# EAGLE schematic load-cell (EAGLE 9.6.2)
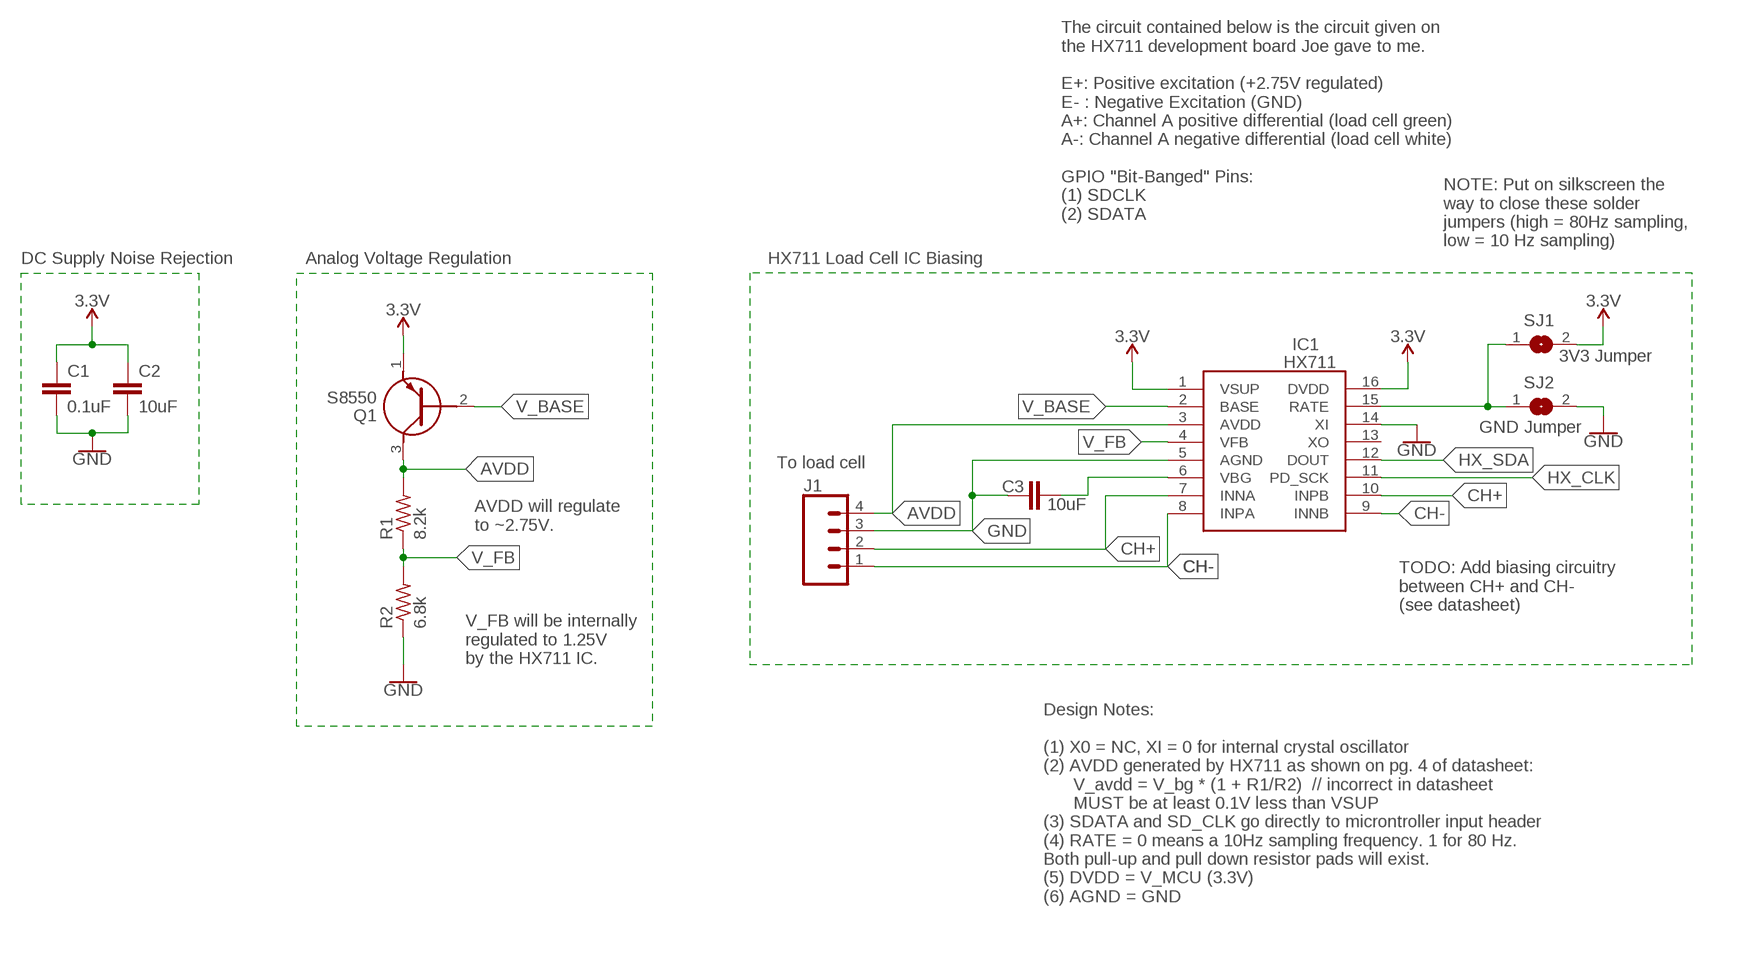
[diagram p0: schematic, sheet 1]

## Parts
C1  0.1uF  CAPACITOR0603  [C0603]
C2  10uF  CAPACITOR0603  [C0603]
C3  10uF  CAPACITOR0603  [C0603]
IC1  HX711  [SOIC127P600X160-16N]
J1  CONN_04  [1X04]
Q1  S8550  [MJE13001TP]
R1  8.2k  RESISTOR0603  [R0603]
R2  6.8k  RESISTOR0603  [R0603]
SJ1  3V3 Jumper  SJ  [SJ]
SJ2  GND Jumper  SJ  [SJ]

## Nets
3.3V: C1.1 C2.1 IC1.1(VSUP) IC1.16(DVDD) Q1.1(E) SJ1.2
AVDD: IC1.3(AVDD) J1.4 Q1.3(C) R1.2
CH+: IC1.7(INNA) IC1.10(INPB) J1.2
CH-: IC1.8(INPA) IC1.9(INNB) J1.1
GND: C1.2 C2.2 C3.1 IC1.5(AGND) IC1.14(XI) J1.3 R2.1 SJ2.2
HX_CLK: IC1.11(PD_SCK)
HX_SDA: IC1.12(DOUT)
N$2: C3.2 IC1.6(VBG)
N$7: IC1.15(RATE) SJ1.1 SJ2.1
V_BASE: IC1.2(BASE) Q1.2(B)
V_FB: IC1.4(VFB) R1.1 R2.2
Unconnected: IC1.13(XO)

## Notes on the sheet
- The circuit contained below is the circuit given on
  the HX711 development board Joe gave to me.
  
  E+: Positive excitation (+2.75V regulated)
  E- : Negative Excitation (GND)
  A+: Channel A positive differential (load cell green)
  A-: Channel A negative differential (load cell white)
  
  GPIO "Bit-Banged" Pins:
  (1) SDCLK
  (2) SDATA
- NOTE: Put on silkscreen the
  way to close these solder
  jumpers (high = 80Hz sampling,
  low = 10 Hz sampling)
- DC Supply Noise Rejection | Analog Voltage Regulation | HX711 Load Cell IC Biasing
- To load cell
- AVDD will regulate 
  to ~2.75V.
- TODO: Add biasing circuitry
  between CH+ and CH-
  (see datasheet)
- V_FB will be internally
  regulated to 1.25V
  by the HX711 IC.
- Design Notes:
  
  (1) X0 = NC, XI = 0 for internal crystal oscillator
  (2) AVDD generated by HX711 as shown on pg. 4 of datasheet:
        V_avdd = V_bg * (1 + R1/R2)  // incorrect in datasheet
        MUST be at least 0.1V less than VSUP
  (3) SDATA and SD_CLK go directly to microntroller input header
  (4) RATE = 0 means a 10Hz sampling frequency. 1 for 80 Hz.
  Both pull-up and pull down resistor pads will exist.
  (5) DVDD = V_MCU (3.3V)
  (6) AGND = GND

## Library data of the parts
C1-C3 = LinnesLab-Passives:CAPACITOR
IC1 = SamacSys_Parts:HX711: 24-Bit Analog-to-Digital Converter (ADC) for Weigh Scale Source: Datasheet <https://cdn.sparkfun.com/datasheets/Sensors/ForceFlex/hx711_english.pdf>; DESCRIPTION: 24-Bit Analog-to-Digital Converter (ADC) for Weigh Scale; HEIGHT: 1.6mm; MANUFACTURER_NAME: AVIA Semiconductor; MANUFACTURER_PART_NUMBER: HX711
J1 = LinnesLab-Connectors:CONN_04: Multi connection point. Often used as Generic Header-pin footprint for 0.1 inch spaced/style header connections On any of the 0.1 inch spaced packages, you can populate with these: Break Away Headers - Straight <https://www.sparkfun.com/products/116> (PRT-00116) Break Away Male Headers - Right Angle <https://www.sparkfun.com/products/553> (PRT-00553) Female Headers <https://www.sparkfun.com/products/115> (PRT-00115) Break Away Headers - Machine Pin <https://www.sparkfun.com/products/117> (PRT-00117) Break Away Female Headers - Swiss Machine Pin <https://www.sparkfun.com/products/743> (PRT-00743) For SCREWTERMINALS and SPRING TERMINALS visit here: Screw Terimnals on SparkFun.com <https://www.sparkfun.com/search/results?term=Screw+Terminals> (5mm/3.5mm/2.54mm spacing) This device is also useful as a general connection point to wire up your design to another part of your project. Our various solder wires solder well into these plated through hole pads. Hook-Up Wire - Assortment (Stranded, 22 AWG) <https://www.sparkfun.com/products/11375> (PRT-11375) Hook-Up Wire - Assortment (Solid Core, 22 AWG) <https://www.sparkfun.com/products/11367> (PRT-11367) View the entire wire category on our website here <https://www.sparkfun.com/categories/141> Special notes: Molex polarized connector foot print use with SKU : PRT-08231 with associated crimp pins and housings. 1MM SMD Version SKU: PRT-10208; PROD_ID: CONN-09696
Q1 = SamacSys_Parts:S8550: PNP Silicon Transistors Source: Datasheet; DESCRIPTION: PNP Silicon Transistors; HEIGHT: mm; MANUFACTURER_NAME: MCC(Micro Commercial Components); MANUFACTURER_PART_NUMBER: S8550
R1 R2 = LinnesLab-Passives:RESISTOR
SJ1 SJ2 = jumper:SJ: SMD solder JUMPER